# EAGLE schematic microsal2 (EAGLE 9.0.0)

## Sheet 1 of 4
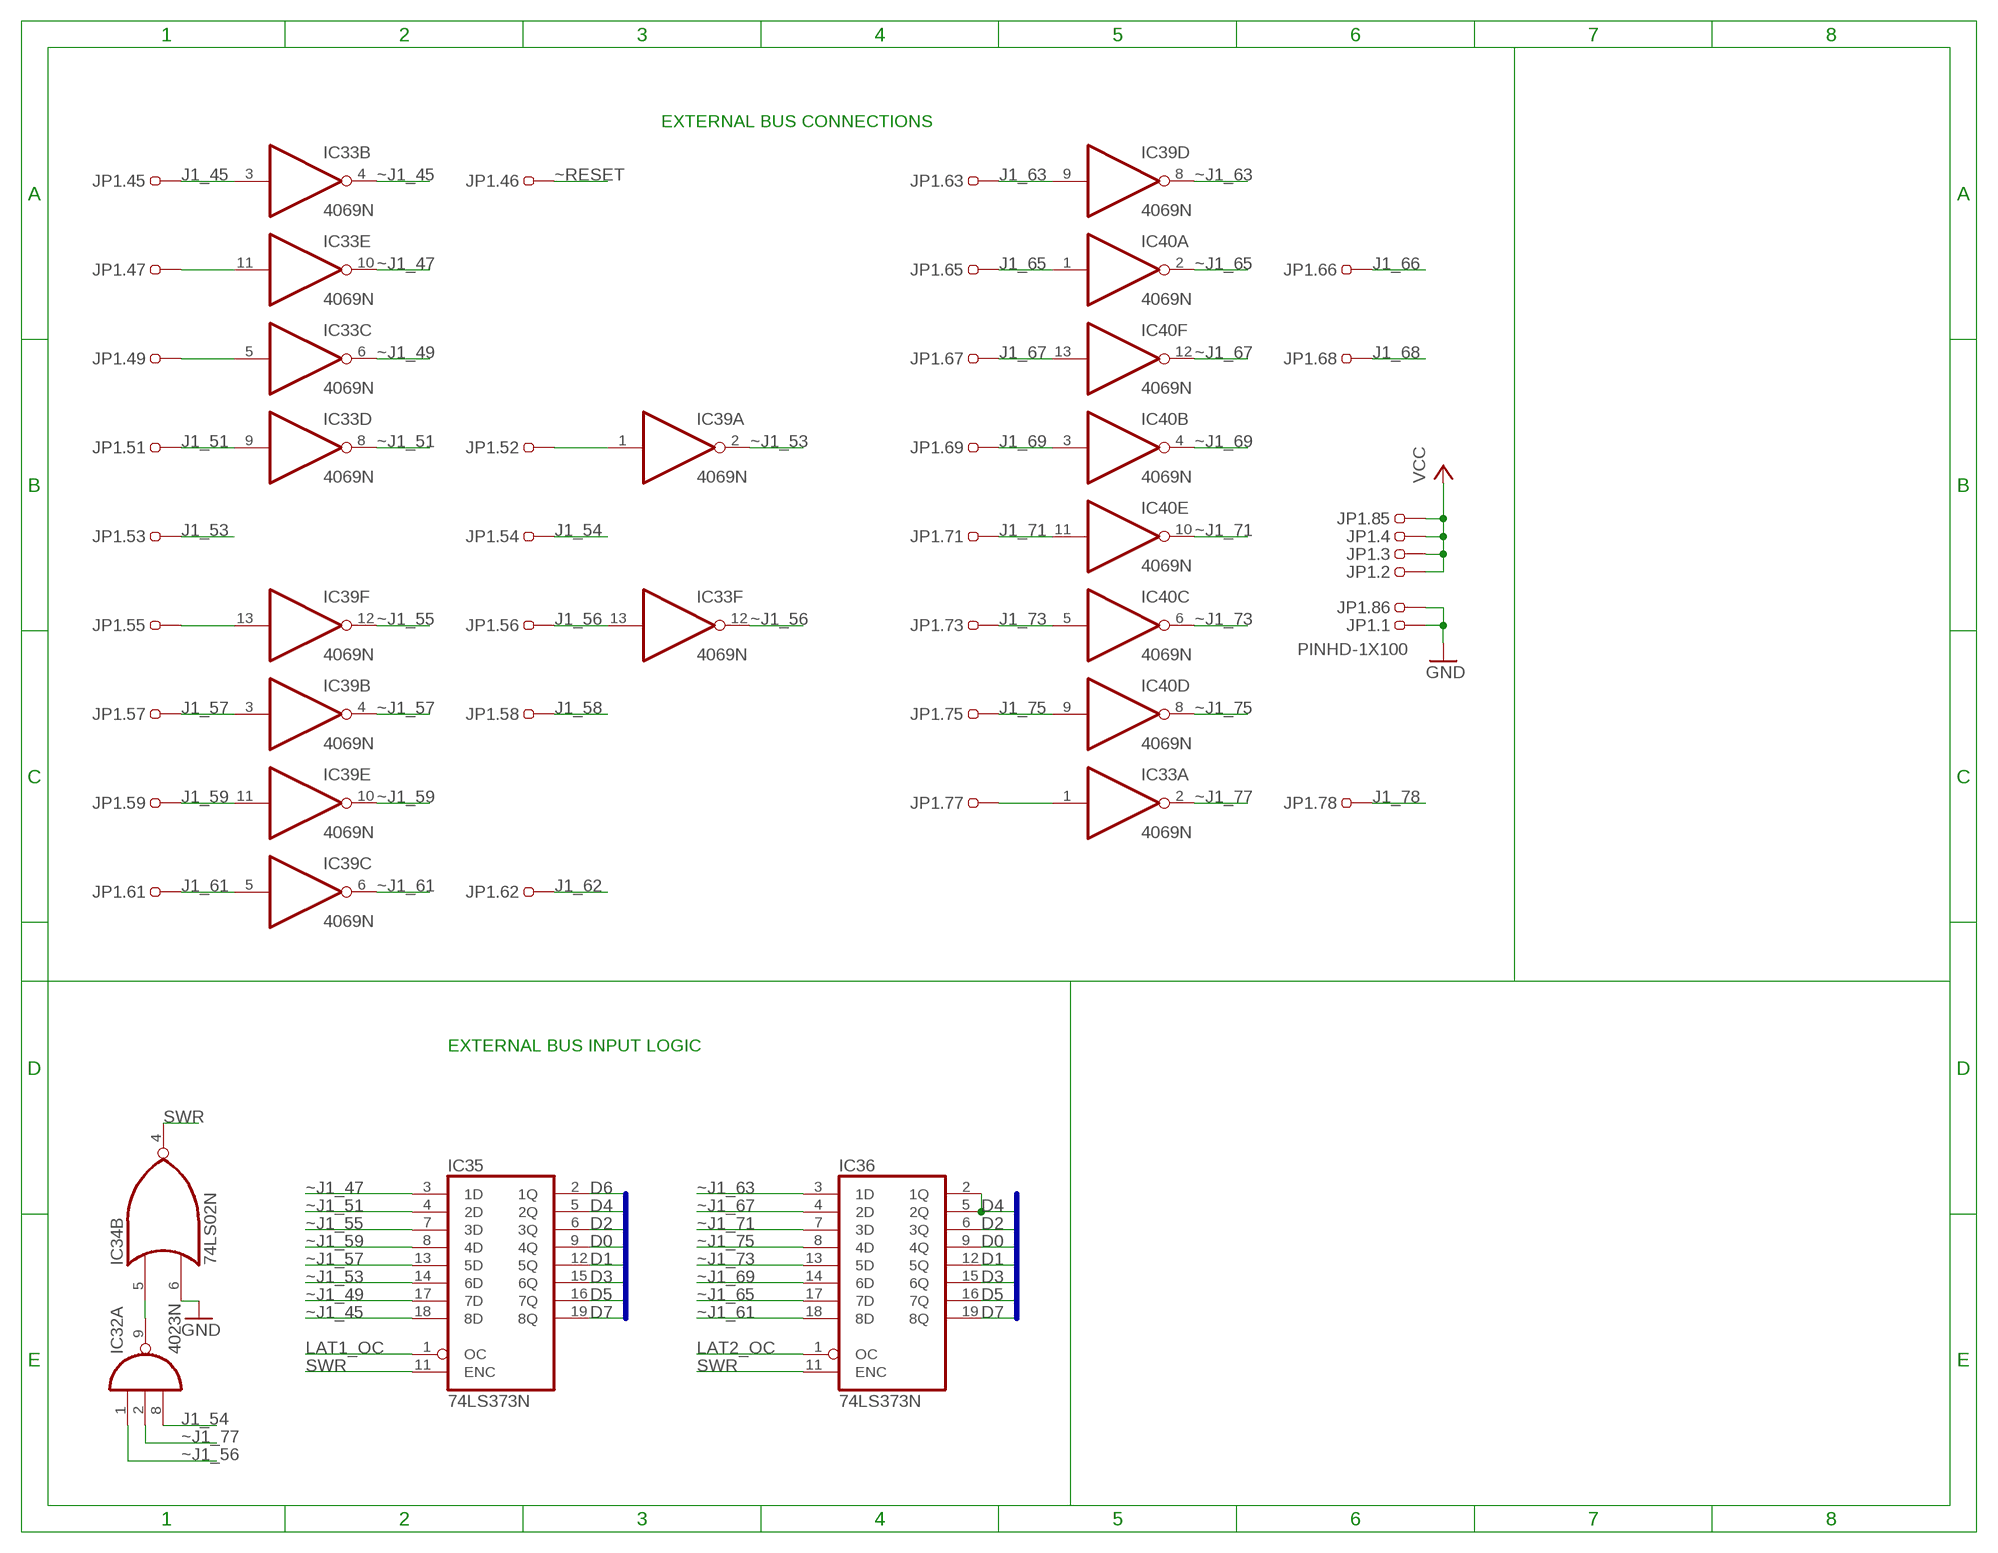
[diagram p0: schematic, sheet 1]

### Parts
IC32  4023N  [DIL14]
IC33  4069N  [DIL14]
IC34  74LS02N  [DIL14]
IC35  74LS373N  [DIL20]
IC36  74LS373N  [DIL20]
IC39  4069N  [DIL14]
IC40  4069N  [DIL14]
JP1  PINHD-1X100  [1X100]

### Nets
D0: IC35.9(4Q) IC36.9(4Q) ; also sheet 2,3,4
D1: IC35.12(5Q) IC36.12(5Q) ; also sheet 2,3,4
D2: IC35.6(3Q) IC36.6(3Q) ; also sheet 2,3,4
D3: IC35.15(6Q) IC36.15(6Q) ; also sheet 2,3,4
D4: IC35.5(2Q) IC36.2(1Q) IC36.5(2Q) ; also sheet 2,3,4
D5: IC35.16(7Q) IC36.16(7Q) ; also sheet 2,3,4
D6: IC35.2(1Q) ; also sheet 2,3,4
D7: IC35.19(8Q) IC36.19(8Q) ; also sheet 2,3,4
GND: IC34.6(B:I1) JP1.1 JP1.86 ; also sheet 2,3,4
J1_45: IC33.3(B:I) JP1.45 ; also sheet 3
J1_51: IC33.9(D:I) JP1.51 ; also sheet 3
J1_53: JP1.53 ; also sheet 3
J1_54: IC32.8(A:I2) JP1.54
J1_56: IC33.13(F:I) JP1.56 ; also sheet 3
J1_57: IC39.3(B:I) JP1.57 ; also sheet 3
J1_58: JP1.58 ; also sheet 3
J1_59: IC39.11(E:I) JP1.59 ; also sheet 3
J1_61: IC39.5(C:I) JP1.61 ; also sheet 3
J1_62: JP1.62 ; also sheet 3
J1_63: IC39.9(D:I) JP1.63 ; also sheet 3
J1_65: IC40.1(A:I) JP1.65 ; also sheet 3
J1_66: JP1.66 ; also sheet 3
J1_67: IC40.13(F:I) JP1.67 ; also sheet 3
J1_68: JP1.68 ; also sheet 3
J1_69: IC40.3(B:I) JP1.69 ; also sheet 3
J1_71: IC40.11(E:I) JP1.71 ; also sheet 3
J1_73: IC40.5(C:I) JP1.73 ; also sheet 3
J1_75: IC40.9(D:I) JP1.75 ; also sheet 3
J1_78: JP1.78 ; also sheet 2
LAT1_OC: IC35.1(OC) ; also sheet 4
LAT2_OC: IC36.1(OC) ; also sheet 4
N$130: IC33.1(A:I) JP1.77
N$132: IC32.9(A:O) IC34.5(B:I0)
N$133: IC33.11(E:I) JP1.47
N$135: IC39.13(F:I) JP1.55
N$138: IC39.1(A:I) JP1.52
N$139: IC33.5(C:I) JP1.49
SWR: IC34.4(B:O) IC35.11(ENC) IC36.11(ENC) ; also sheet 4
VCC: JP1.2 JP1.3 JP1.4 JP1.85 ; also sheet 2,3,4
~J1_45: IC33.4(B:O) IC35.18(8D)
~J1_47: IC33.10(E:O) IC35.3(1D)
~J1_49: IC33.6(C:O) IC35.17(7D)
~J1_51: IC33.8(D:O) IC35.4(2D)
~J1_53: IC35.14(6D) IC39.2(A:O)
~J1_55: IC35.7(3D) IC39.12(F:O)
~J1_56: IC32.1(A:I0) IC33.12(F:O)
~J1_57: IC35.13(5D) IC39.4(B:O)
~J1_59: IC35.8(4D) IC39.10(E:O)
~J1_61: IC36.18(8D) IC39.6(C:O)
~J1_63: IC36.3(1D) IC39.8(D:O)
~J1_65: IC36.17(7D) IC40.2(A:O)
~J1_67: IC36.4(2D) IC40.12(F:O)
~J1_69: IC36.14(6D) IC40.4(B:O)
~J1_71: IC36.7(3D) IC40.10(E:O)
~J1_73: IC36.13(5D) IC40.6(C:O)
~J1_75: IC36.8(4D) IC40.8(D:O)
~J1_77: IC32.2(A:I1) IC33.2(A:O) ; also sheet 3
~RESET: JP1.46 ; also sheet 2,4
Unconnected: IC32.3(B:I0) IC32.4(B:I1) IC32.5(B:I2) IC32.6(B:O) IC32.10(C:O) IC32.11(C:I0) IC32.12(C:I1) IC32.13(C:I2) IC34.1(A:O) IC34.2(A:I0) IC34.3(A:I1) IC34.8(C:I0) IC34.9(C:I1) IC34.10(C:O) IC34.11(D:I0) IC34.12(D:I1) IC34.13(D:O) JP1.5 JP1.6 JP1.7 JP1.8 JP1.9 JP1.10 JP1.11 JP1.12 JP1.13 JP1.14 JP1.15 JP1.16 JP1.17 JP1.18 JP1.19 JP1.20 JP1.21 JP1.22 JP1.23 JP1.24 JP1.25 JP1.26 JP1.27 JP1.28 JP1.29 JP1.30 JP1.31 JP1.32 JP1.33 JP1.34 JP1.35 JP1.36 JP1.37 JP1.38 JP1.39 JP1.40 JP1.41 JP1.42 JP1.43 JP1.44 JP1.48 JP1.50 JP1.60 JP1.64 JP1.70 JP1.72 JP1.74 JP1.76 JP1.79 JP1.80 JP1.81 JP1.82 JP1.83 JP1.84 JP1.87 JP1.88 JP1.89 JP1.90 JP1.91 JP1.92 JP1.93 JP1.94 JP1.95 JP1.96 JP1.97 JP1.98 JP1.99 JP1.100

### Buses
D[0..7]

### Notes on the sheet
- EXTERNAL BUS CONNECTIONS
- EXTERNAL BUS INPUT LOGIC

## Sheet 2 of 4
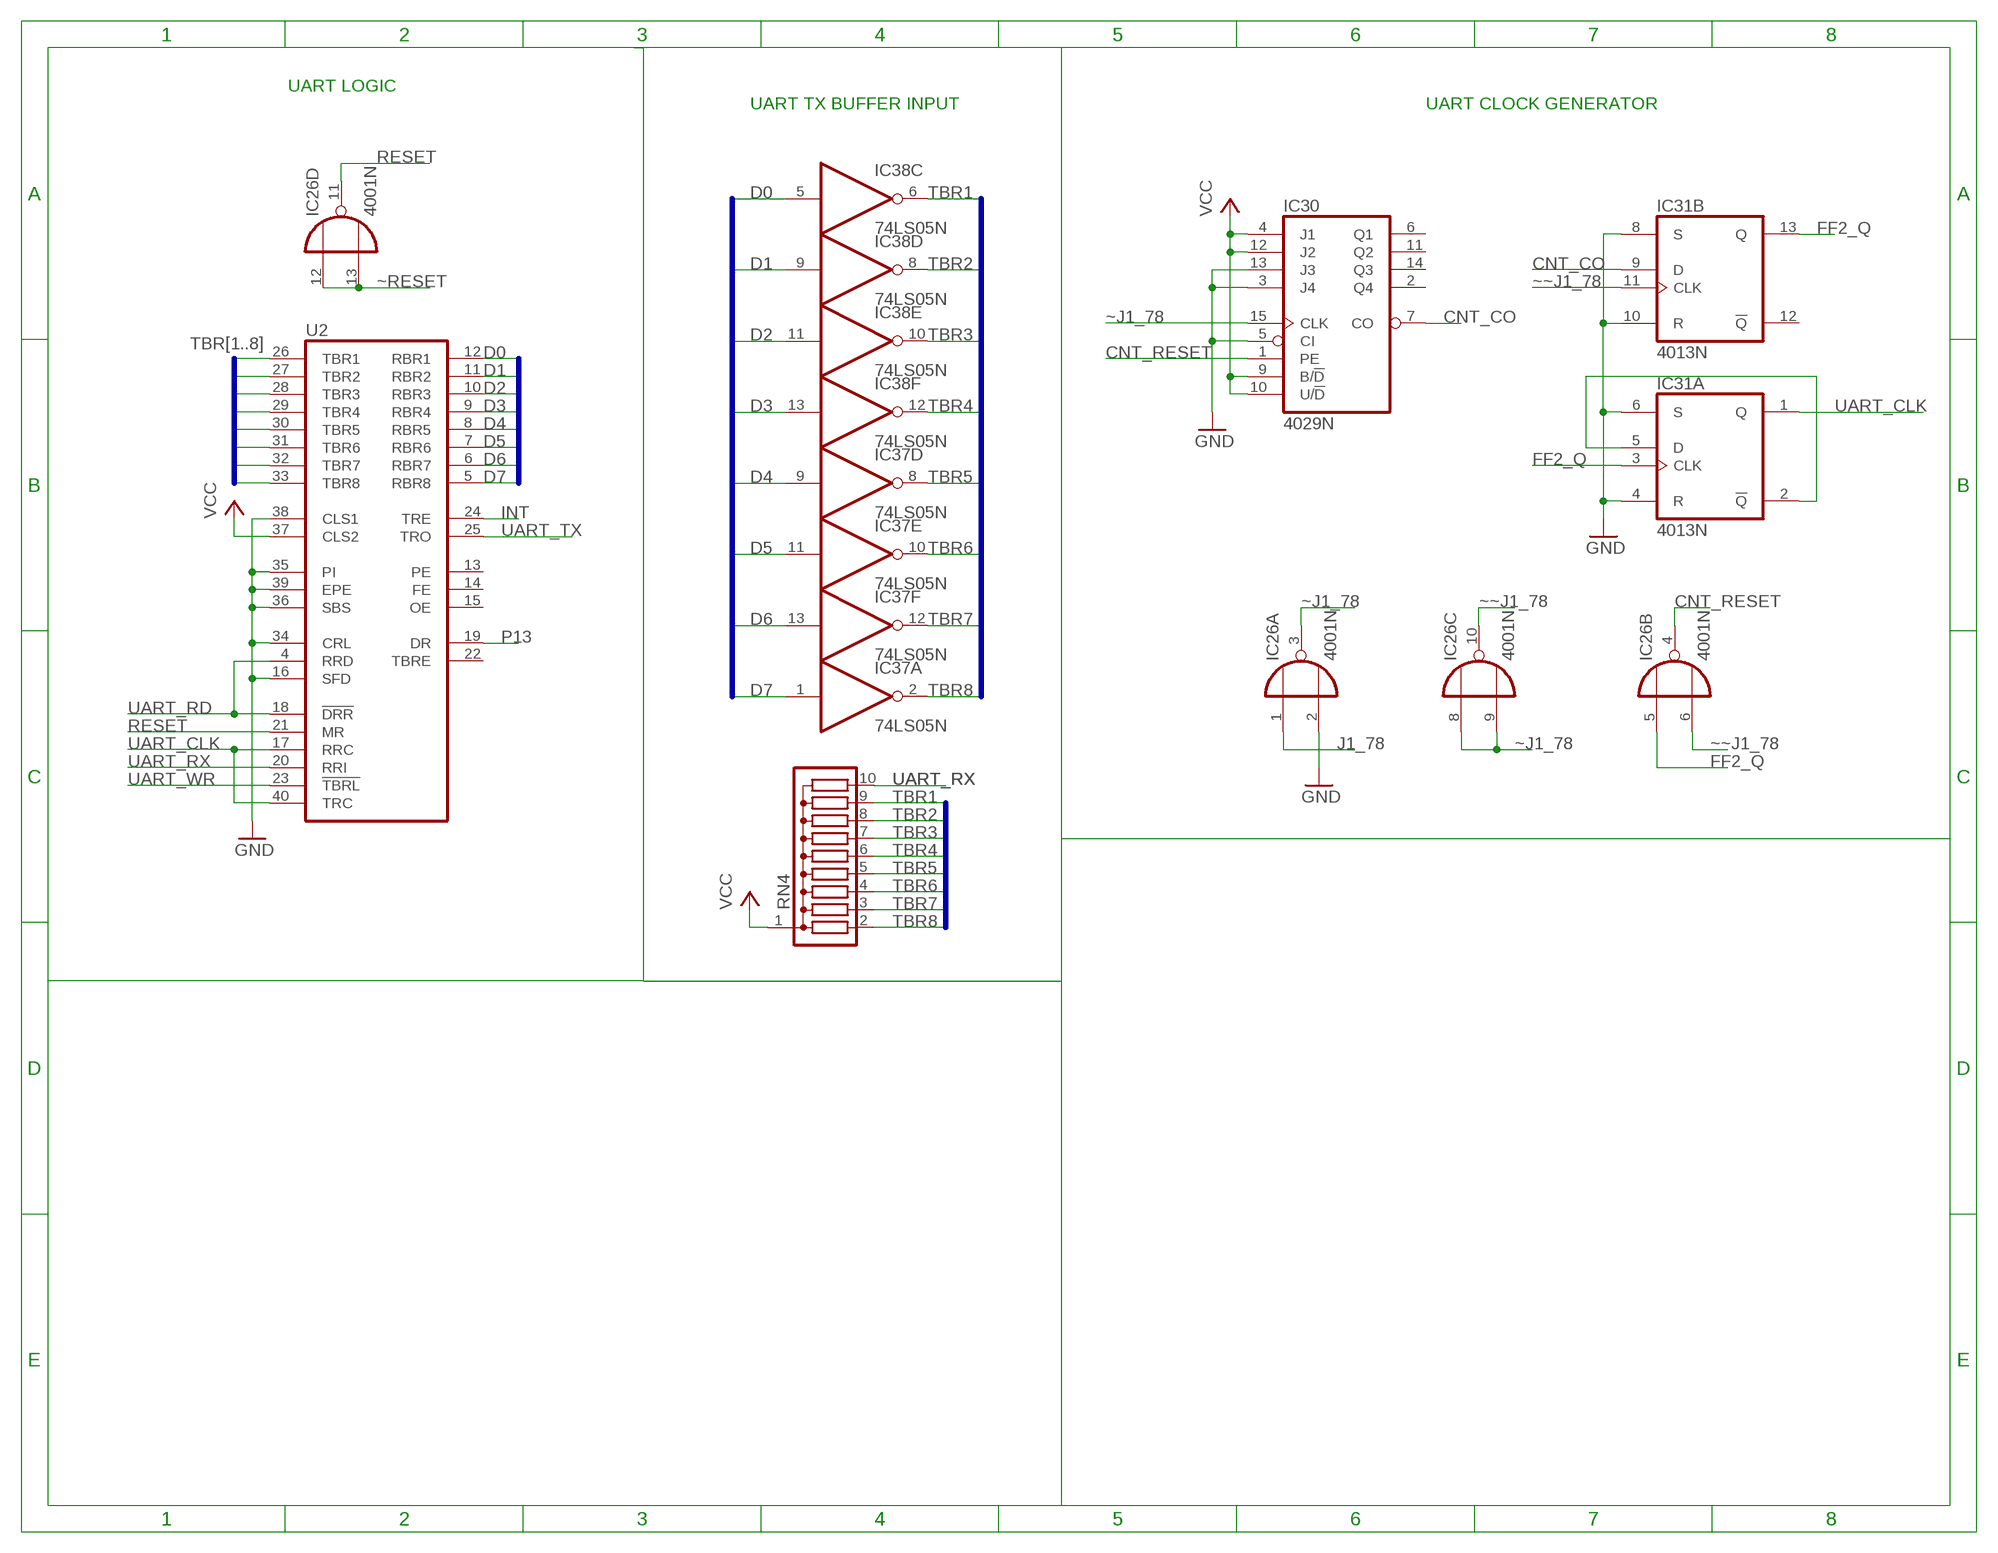
[diagram p1: schematic, sheet 2]

### Parts
IC26  4001N  [DIL14]
IC30  4029N  [DIL16]
IC31  4013N  [DIL14]
IC37  74LS05N  [DIL14]
IC38  74LS05N  [DIL14]
RN4  G09R  [SIL10]
U2  HD6402  [DIL40]

### Nets
CNT_CO: IC30.7(CO) IC31.9(B:D)
CNT_RESET: IC26.4(B:O) IC30.1(PE)
D0: IC38.5(C:I) U2.12(RBR1) ; also sheet 1,3,4
D1: IC38.9(D:I) U2.11(RBR2) ; also sheet 1,3,4
D2: IC38.11(E:I) U2.10(RBR3) ; also sheet 1,3,4
D3: IC38.13(F:I) U2.9(RBR4) ; also sheet 1,3,4
D4: IC37.9(D:I) U2.8(RBR5) ; also sheet 1,3,4
D5: IC37.11(E:I) U2.7(RBR6) ; also sheet 1,3,4
D6: IC37.13(F:I) U2.6(RBR7) ; also sheet 1,3,4
D7: IC37.1(A:I) U2.5(RBR8) ; also sheet 1,3,4
FF2_Q: IC26.5(B:I0) IC31.3(A:CLK) IC31.13(B:Q)
GND: IC26.2(A:I1) IC30.3(J4) IC30.5(CI) IC30.13(J3) IC31.4(A:R) IC31.6(A:S) IC31.8(B:S) IC31.10(B:R) U2.16(SFD) U2.34(CRL) U2.35(PI) U2.36(SBS) U2.38(CLS1) U2.39(EPE) ; also sheet 1,3,4
INT: U2.24(TRE) ; also sheet 4
J1_78: IC26.1(A:I0) ; also sheet 1
N$40: IC31.2(A:!Q) IC31.5(A:D)
P13: U2.19(DR) ; also sheet 4
RESET: IC26.11(D:O) U2.21(MR)
TBR1: IC38.6(C:O) RN4.9 U2.26(TBR1)
TBR2: IC38.8(D:O) RN4.8 U2.27(TBR2)
TBR3: IC38.10(E:O) RN4.7 U2.28(TBR3)
TBR4: IC38.12(F:O) RN4.6 U2.29(TBR4)
TBR5: IC37.8(D:O) RN4.5 U2.30(TBR5)
TBR6: IC37.10(E:O) RN4.4 U2.31(TBR6)
TBR7: IC37.12(F:O) RN4.3 U2.32(TBR7)
TBR8: IC37.2(A:O) RN4.2 U2.33(TBR8)
UART_CLK: IC31.1(A:Q) U2.17(RRC) U2.40(TRC)
UART_RD: U2.4(RRD) U2.18(!DRR) ; also sheet 4
UART_RX: RN4.10 U2.20(RRI) ; also sheet 4
UART_TX: U2.25(TRO) ; also sheet 4
UART_WR: U2.23(!TBRL) ; also sheet 4
VCC: IC30.4(J1) IC30.9(B/!D) IC30.10(U/!D) IC30.12(J2) RN4.1 U2.37(CLS2) ; also sheet 1,3,4
~J1_78: IC26.3(A:O) IC26.8(C:I0) IC26.9(C:I1) IC30.15(CLK)
~RESET: IC26.12(D:I0) IC26.13(D:I1) ; also sheet 1,4
~~J1_78: IC26.6(B:I1) IC26.10(C:O) IC31.11(B:CLK)
Unconnected: IC30.2(Q4) IC30.6(Q1) IC30.11(Q2) IC30.14(Q3) IC31.12(B:!Q) IC37.3(B:I) IC37.4(B:O) IC37.5(C:I) IC37.6(C:O) IC38.1(A:I) IC38.2(A:O) IC38.3(B:I) IC38.4(B:O) U2.13(PE) U2.14(FE) U2.15(OE) U2.22(TBRE)

### Buses
D[0..7]
TBR[1..8]

### Notes on the sheet
- UART LOGIC
- UART TX BUFFER INPUT | UART CLOCK GENERATOR

## Sheet 3 of 4
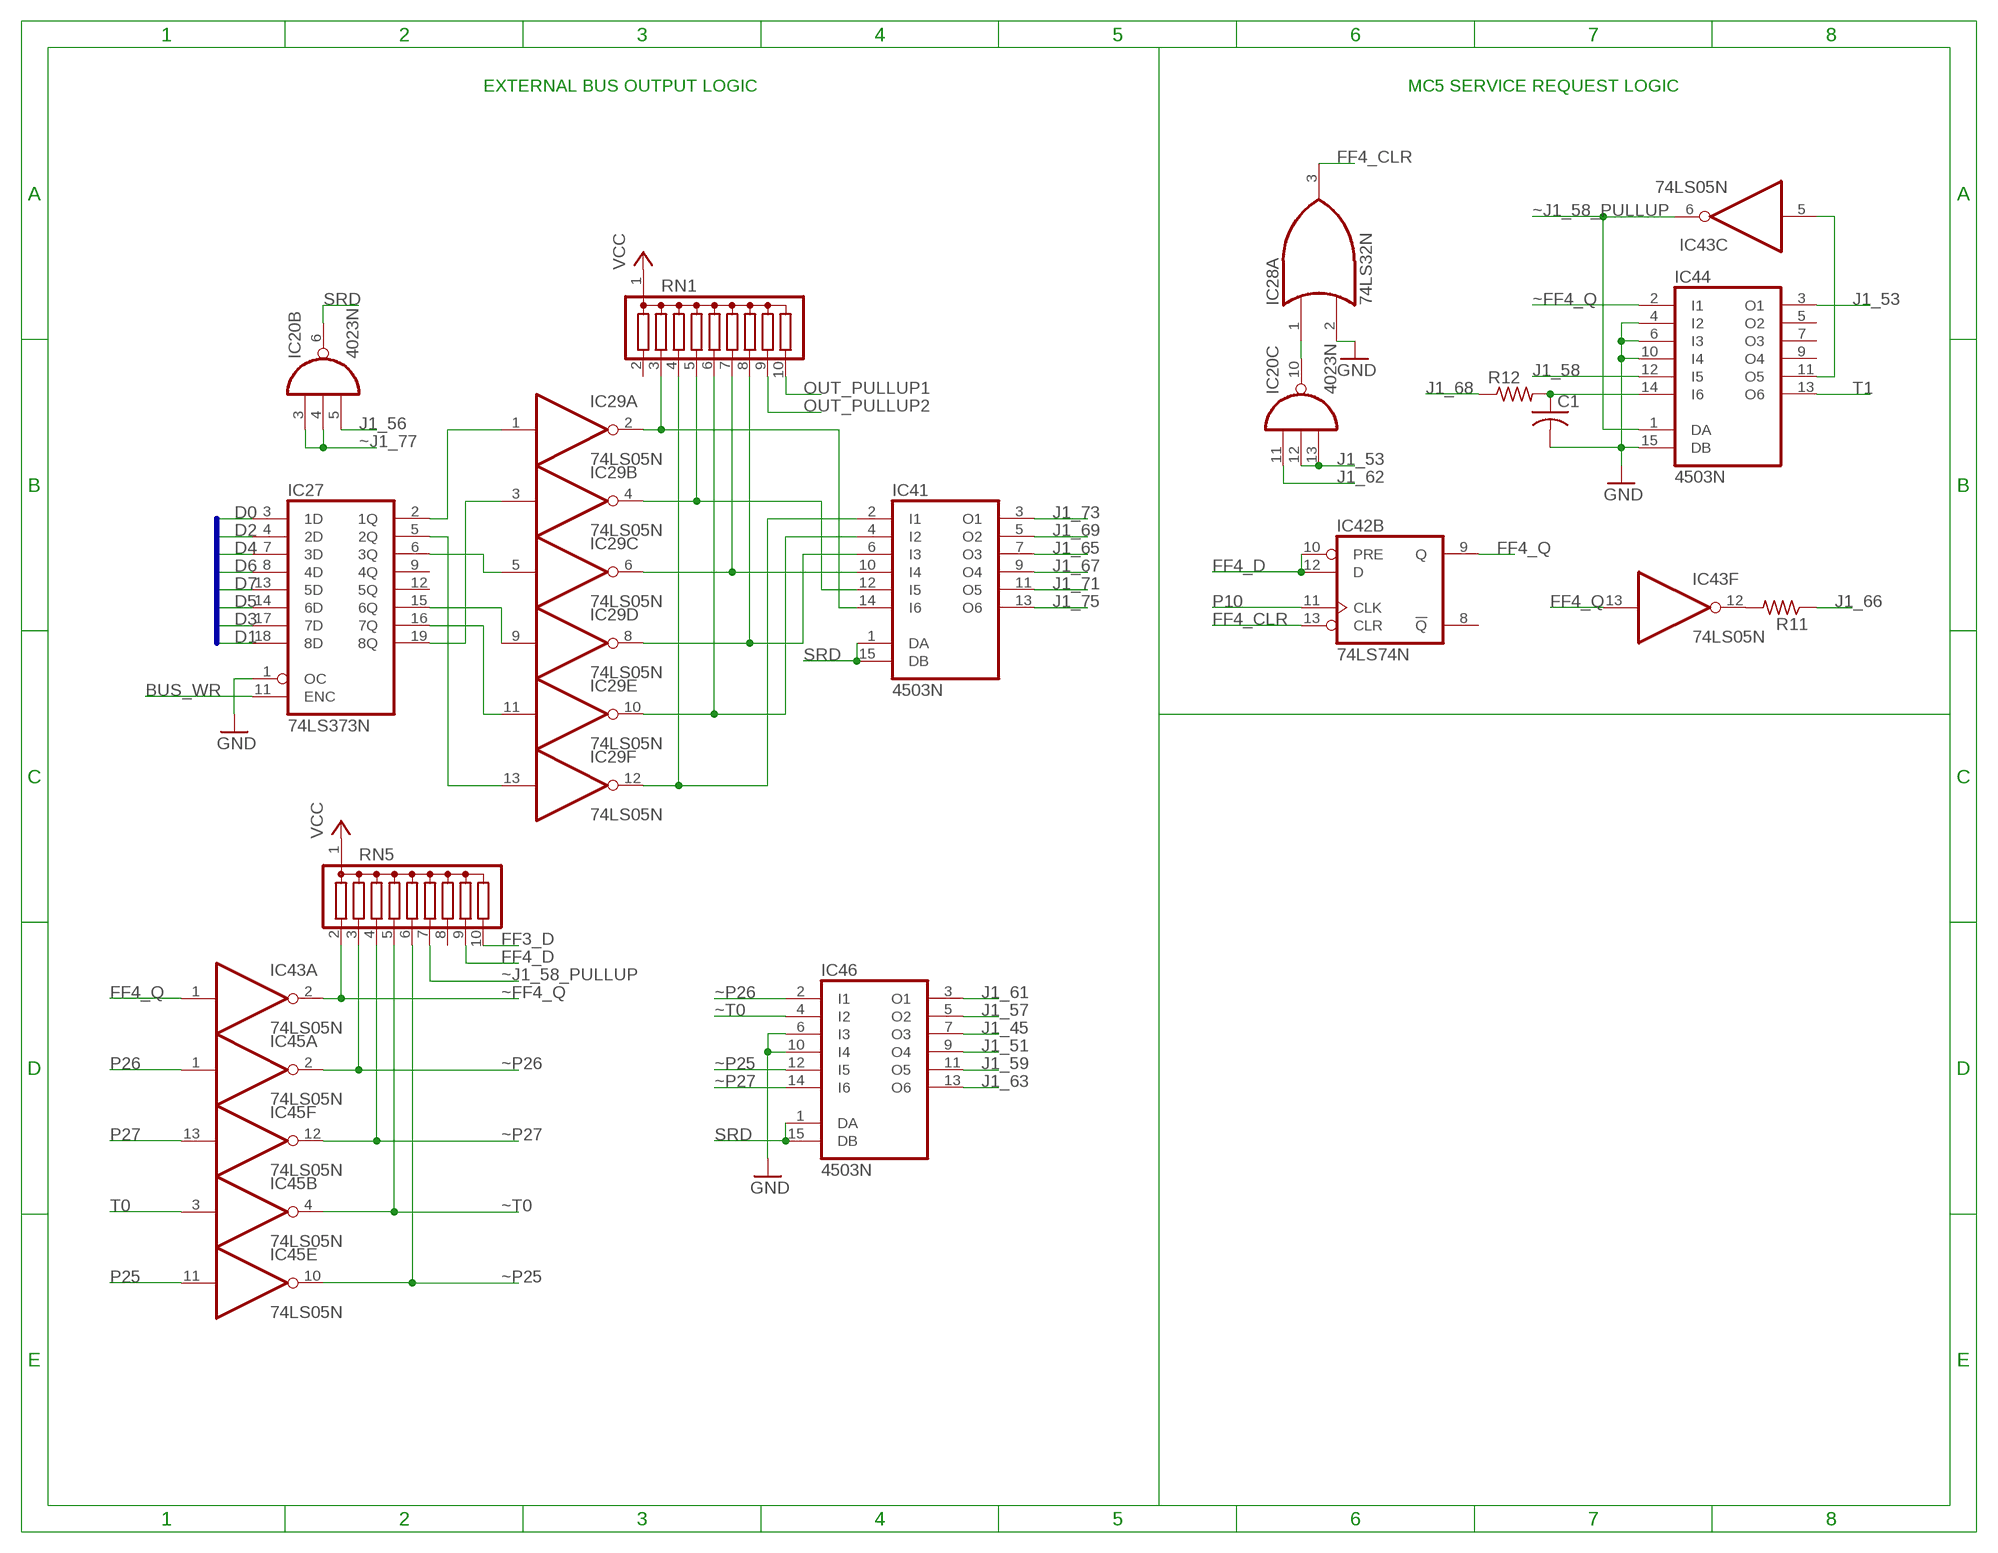
[diagram p2: schematic, sheet 3]

### Parts
C1  C-US050-025X075  [C050-025X075]
IC20  4023N  [DIL14]
IC27  74LS373N  [DIL20]
IC28  74LS32N  [DIL14]
IC29  74LS05N  [DIL14]
IC41  4503N  [DIL16]
IC42  74LS74N  [DIL14]
IC43  74LS05N  [DIL14]
IC44  4503N  [DIL16]
IC45  74LS05N  [DIL14]
IC46  4503N  [DIL16]
R11  R-US_0207/10  [0207/10]
R12  R-US_0207/10  [0207/10]
RN1  G09R  [SIL10]
RN5  G09R  [SIL10]

### Nets
BUS_WR: IC27.11(ENC) ; also sheet 4
D0: IC27.3(1D) ; also sheet 1,2,4
D1: IC27.18(8D) ; also sheet 1,2,4
D2: IC27.4(2D) ; also sheet 1,2,4
D3: IC27.17(7D) ; also sheet 1,2,4
D4: IC27.7(3D) ; also sheet 1,2,4
D5: IC27.14(6D) ; also sheet 1,2,4
D6: IC27.8(4D) ; also sheet 1,2,4
D7: IC27.13(5D) ; also sheet 1,2,4
FF3_D: RN5.10 ; also sheet 4
FF4_CLR: IC28.3(A:O) IC42.13(B:CLR)
FF4_D: IC42.10(B:PRE) IC42.12(B:D) RN5.9
FF4_Q: IC42.9(B:Q) IC43.1(A:I) IC43.13(F:I)
GND: C1.2 IC27.1(OC) IC28.2(A:I1) IC44.4(I2) IC44.6(I3) IC44.10(I4) IC44.15(DB) IC46.6(I3) IC46.10(I4) ; also sheet 1,2,4
J1_45: IC46.7(O3) ; also sheet 1
J1_51: IC46.9(O4) ; also sheet 1
J1_53: IC20.12(C:I1) IC20.13(C:I2) IC44.3(O1) ; also sheet 1
J1_56: IC20.5(B:I2) ; also sheet 1
J1_57: IC46.5(O2) ; also sheet 1
J1_58: IC44.12(I5) ; also sheet 1
J1_59: IC46.11(O5) ; also sheet 1
J1_61: IC46.3(O1) ; also sheet 1
J1_62: IC20.11(C:I0) ; also sheet 1
J1_63: IC46.13(O6) ; also sheet 1
J1_65: IC41.7(O3) ; also sheet 1
J1_66: R11.1 ; also sheet 1
J1_67: IC41.9(O4) ; also sheet 1
J1_68: R12.1 ; also sheet 1
J1_69: IC41.5(O2) ; also sheet 1
J1_71: IC41.11(O5) ; also sheet 1
J1_73: IC41.3(O1) ; also sheet 1
J1_75: IC41.13(O6) ; also sheet 1
N$36: IC27.2(1Q) IC29.1(A:I)
N$38: IC27.5(2Q) IC29.13(F:I)
N$39: IC27.6(3Q) IC29.5(C:I)
N$41: IC27.15(6Q) IC29.9(D:I)
N$42: IC27.16(7Q) IC29.11(E:I)
N$43: IC27.19(8Q) IC29.3(B:I)
N$44: IC29.2(A:O) IC41.14(I6) RN1.3
N$45: IC29.4(B:O) IC41.12(I5) RN1.5
N$46: IC29.6(C:O) IC41.10(I4) RN1.7
N$47: IC29.8(D:O) IC41.6(I3) RN1.8
N$48: IC29.10(E:O) IC41.4(I2) RN1.6
N$49: IC29.12(F:O) IC41.2(I1) RN1.4
N$50: IC20.10(C:O) IC28.1(A:I0)
N$51: IC43.12(F:O) R11.2
N$52: C1.1 IC44.14(I6) R12.2
N$53: IC43.5(C:I) IC44.11(O5)
OUT_PULLUP1: RN1.10 ; also sheet 4
OUT_PULLUP2: RN1.9 ; also sheet 4
P10: IC42.11(B:CLK) ; also sheet 4
P25: IC45.11(E:I) ; also sheet 4
P26: IC45.1(A:I) ; also sheet 4
P27: IC45.13(F:I) ; also sheet 4
SRD: IC20.6(B:O) IC41.1(DA) IC41.15(DB) IC46.1(DA) IC46.15(DB)
T0: IC45.3(B:I) ; also sheet 4
T1: IC44.13(O6) ; also sheet 4
VCC: RN1.1 RN5.1 ; also sheet 1,2,4
~FF4_Q: IC43.2(A:O) IC44.2(I1) RN5.2
~J1_58_PULLUP: IC43.6(C:O) IC44.1(DA) RN5.7
~J1_77: IC20.3(B:I0) IC20.4(B:I1) ; also sheet 1
~P25: IC45.10(E:O) IC46.12(I5) RN5.6
~P26: IC45.2(A:O) IC46.2(I1) RN5.3
~P27: IC45.12(F:O) IC46.14(I6) RN5.4
~T0: IC45.4(B:O) IC46.4(I2) RN5.5
Unconnected: IC20.1(A:I0) IC20.2(A:I1) IC20.8(A:I2) IC20.9(A:O) IC27.9(4Q) IC27.12(5Q) IC28.4(B:I0) IC28.5(B:I1) IC28.6(B:O) IC28.8(C:O) IC28.9(C:I0) IC28.10(C:I1) IC28.11(D:O) IC28.12(D:I0) IC28.13(D:I1) IC42.1(A:CLR) IC42.2(A:D) IC42.3(A:CLK) IC42.4(A:PRE) IC42.5(A:Q) IC42.6(A:!Q) IC42.8(B:!Q) IC43.3(B:I) IC43.4(B:O) IC43.8(D:O) IC43.9(D:I) IC43.10(E:O) IC43.11(E:I) IC44.5(O2) IC44.7(O3) IC44.9(O4) IC45.5(C:I) IC45.6(C:O) IC45.8(D:O) IC45.9(D:I) RN1.2 RN5.8

### Buses
D[0..7]

### Notes on the sheet
- EXTERNAL BUS OUTPUT LOGIC | MC5 SERVICE REQUEST LOGIC

## Sheet 4 of 4
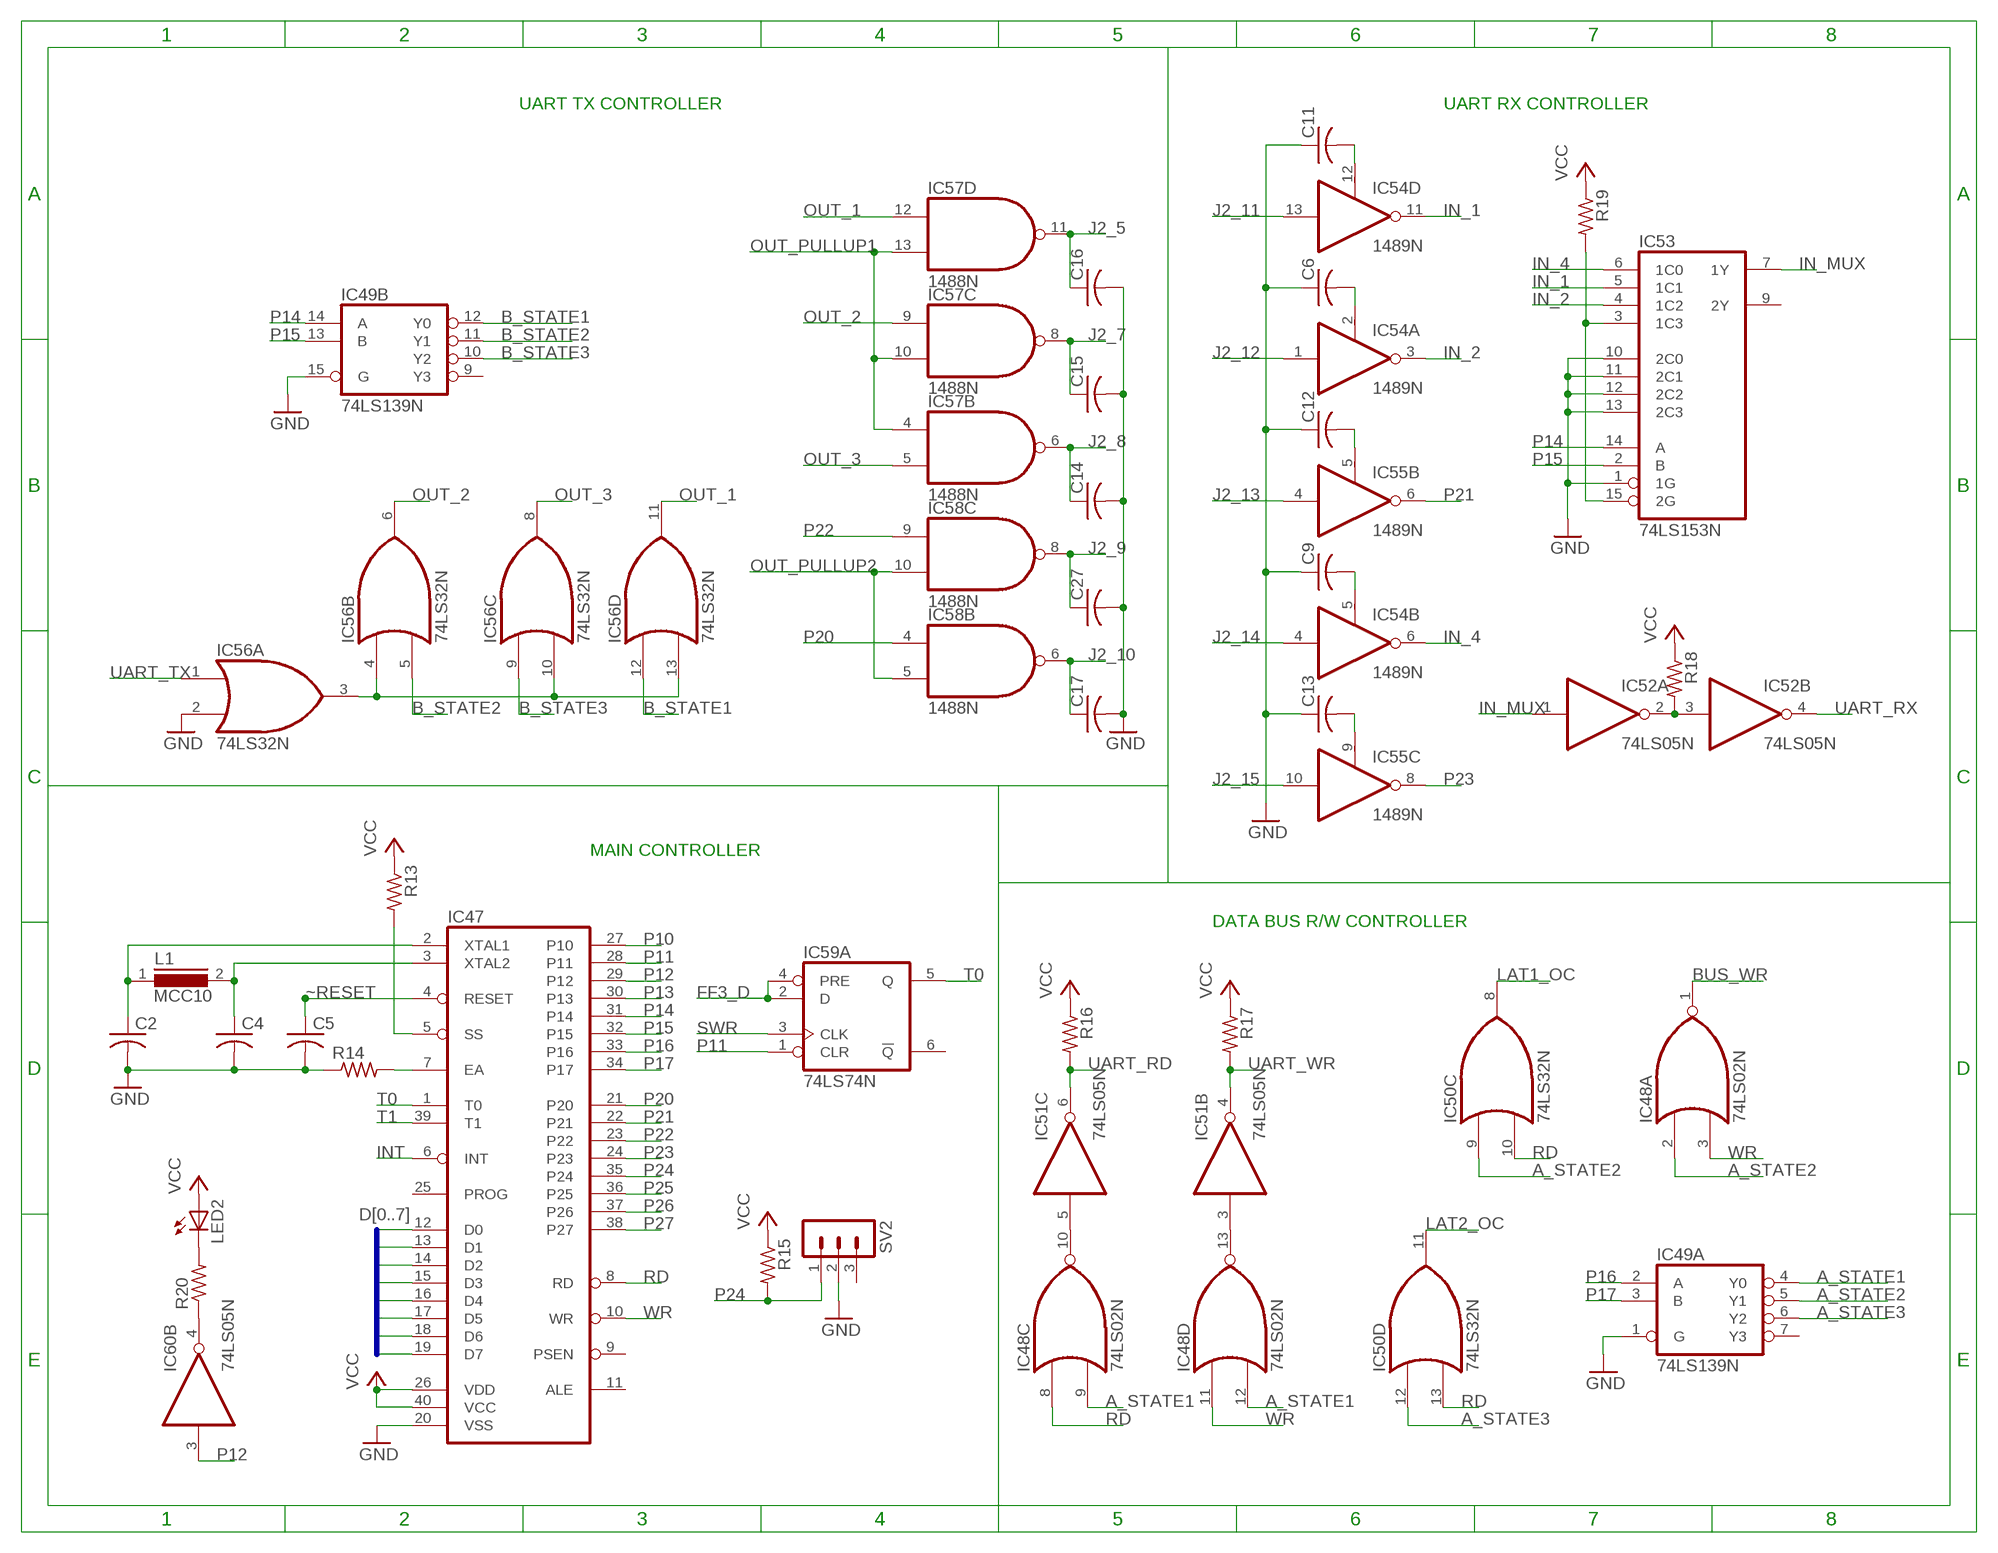
[diagram p3: schematic, sheet 4]

### Parts
C2  C-US050-025X075  [C050-025X075]
C4  C-US050-025X075  [C050-025X075]
C5  C-US050-025X075  [C050-025X075]
C6  C-US050-025X075  [C050-025X075]
C9  C-US050-025X075  [C050-025X075]
C11  C-US050-025X075  [C050-025X075]
C12  C-US050-025X075  [C050-025X075]
C13  C-US050-025X075  [C050-025X075]
C14  C-US050-025X075  [C050-025X075]
C15  C-US050-025X075  [C050-025X075]
C16  C-US050-025X075  [C050-025X075]
C17  C-US050-025X075  [C050-025X075]
C27  C-US050-025X075  [C050-025X075]
IC47  8749  [DIL40]
IC48  74LS02N  [DIL14]
IC49  74LS139N  [DIL16]
IC50  74LS32N  [DIL14]
IC51  74LS05N  [DIL14]
IC52  74LS05N  [DIL14]
IC53  74LS153N  [DIL16]
IC54  1489N  [DIL14]
IC55  1489N  [DIL14]
IC56  74LS32N  [DIL14]
IC57  1488N  [DIL14]
IC58  1488N  [DIL14]
IC59  74LS74N  [DIL14]
IC60  74LS05N  [DIL14]
L1  MCC10  [MCC10]
LED2  LED5MM  [LED5MM]
R13  R-US_0207/10  [0207/10]
R14  R-US_0207/10  [0207/10]
R15  R-US_0207/10  [0207/10]
R16  R-US_0207/10  [0207/10]
R17  R-US_0207/10  [0207/10]
R18  R-US_0207/10  [0207/10]
R19  R-US_0207/10  [0207/10]
R20  R-US_0207/10  [0207/10]
SV2  MA03-1  [MA03-1]

### Nets
A_STATE1: IC48.9(C:I1) IC48.12(D:I1) IC49.4(A:Y0)
A_STATE2: IC48.2(A:I0) IC49.5(A:Y1) IC50.9(C:I0)
A_STATE3: IC49.6(A:Y2) IC50.12(D:I0)
B_STATE1: IC49.12(B:Y0) IC56.12(D:I0)
B_STATE2: IC49.11(B:Y1) IC56.5(B:I1)
B_STATE3: IC49.10(B:Y2) IC56.9(C:I0)
BUS_WR: IC48.1(A:O) ; also sheet 3
D0: IC47.12(D0) ; also sheet 1,2,3
D1: IC47.13(D1) ; also sheet 1,2,3
D2: IC47.14(D2) ; also sheet 1,2,3
D3: IC47.15(D3) ; also sheet 1,2,3
D4: IC47.16(D4) ; also sheet 1,2,3
D5: IC47.17(D5) ; also sheet 1,2,3
D6: IC47.18(D6) ; also sheet 1,2,3
D7: IC47.19(D7) ; also sheet 1,2,3
FF3_D: IC59.2(A:D) IC59.4(A:PRE) ; also sheet 3
GND: C2.2 C4.2 C5.2 C6.1 C9.1 C11.1 C12.1 C13.1 C14.2 C15.2 C16.2 C17.2 C27.2 IC47.20(VSS) IC49.1(A:G) IC49.15(B:G) IC53.1(1G) IC53.10(2C0) IC53.11(2C1) IC53.12(2C2) IC53.13(2C3) IC56.2(A:I1) R14.1 SV2.2 ; also sheet 1,2,3
IN_1: IC53.5(1C1) IC54.11(D:O)
IN_2: IC53.4(1C2) IC54.3(A:O)
IN_4: IC53.6(1C0) IC54.6(B:O)
IN_MUX: IC52.1(A:I) IC53.7(1Y)
INT: IC47.6(INT) ; also sheet 2
J2_5: C16.1 IC57.11(D:O)
J2_7: C15.1 IC57.8(C:O)
J2_8: C14.1 IC57.6(B:O)
J2_9: C27.1 IC58.8(C:O)
J2_10: C17.1 IC58.6(B:O)
J2_11: IC54.13(D:I)
J2_12: IC54.1(A:I)
J2_13: IC55.4(B:I)
J2_14: IC54.4(B:I)
J2_15: IC55.10(C:I)
LAT1_OC: IC50.8(C:O) ; also sheet 1
LAT2_OC: IC50.11(D:O) ; also sheet 1
N$59: C2.1 IC47.2(XTAL1) L1.1
N$60: C4.1 IC47.3(XTAL2) L1.2
N$61: IC47.5(SS) R13.2
N$62: IC47.7(EA) R14.2
N$63: IC48.10(C:O) IC51.5(C:I)
N$64: IC48.13(D:O) IC51.3(B:I)
N$65: C6.2 IC54.2(A:RC)
N$66: C9.2 IC54.5(B:RC)
N$67: C11.2 IC54.12(D:RC)
N$68: C12.2 IC55.5(B:RC)
N$69: C13.2 IC55.9(C:RC)
N$70: IC53.3(1C3) IC53.15(2G) R19.2
N$71: IC56.3(A:O) IC56.4(B:I0) IC56.10(C:I1) IC56.13(D:I1)
N$72: LED2.K(C) R20.2
N$73: IC60.4(B:O) R20.1
N$74: IC52.2(A:O) IC52.3(B:I) R18.2
OUT_1: IC56.11(D:O) IC57.12(D:I0)
OUT_2: IC56.6(B:O) IC57.9(C:I0)
OUT_3: IC56.8(C:O) IC57.5(B:I1)
OUT_PULLUP1: IC57.4(B:I0) IC57.10(C:I1) IC57.13(D:I1) ; also sheet 3
OUT_PULLUP2: IC58.5(B:I1) IC58.10(C:I1) ; also sheet 3
P10: IC47.27(P10) ; also sheet 3
P11: IC47.28(P11) IC59.1(A:CLR)
P12: IC47.29(P12) IC60.3(B:I)
P13: IC47.30(P13) ; also sheet 2
P14: IC47.31(P14) IC49.14(B:A) IC53.14(A)
P15: IC47.32(P15) IC49.13(B:B) IC53.2(B)
P16: IC47.33(P16) IC49.2(A:A)
P17: IC47.34(P17) IC49.3(A:B)
P20: IC47.21(P20) IC58.4(B:I0)
P21: IC47.22(P21) IC55.6(B:O)
P22: IC47.23(P22) IC58.9(C:I0)
P23: IC47.24(P23) IC55.8(C:O)
P24: IC47.35(P24) R15.2 SV2.1
P25: IC47.36(P25) ; also sheet 3
P26: IC47.37(P26) ; also sheet 3
P27: IC47.38(P27) ; also sheet 3
RD: IC47.8(RD) IC48.8(C:I0) IC50.10(C:I1) IC50.13(D:I1)
SWR: IC59.3(A:CLK) ; also sheet 1
T0: IC47.1(T0) IC59.5(A:Q) ; also sheet 3
T1: IC47.39(T1) ; also sheet 3
UART_RD: IC51.6(C:O) R16.2 ; also sheet 2
UART_RX: IC52.4(B:O) ; also sheet 2
UART_TX: IC56.1(A:I0) ; also sheet 2
UART_WR: IC51.4(B:O) R17.2 ; also sheet 2
VCC: IC47.26(VDD) IC47.40(VCC) LED2.A R13.1 R15.1 R16.1 R17.1 R18.1 R19.1 ; also sheet 1,2,3
WR: IC47.10(WR) IC48.3(A:I1) IC48.11(D:I0)
~RESET: C5.1 IC47.4(RESET) ; also sheet 1,2
Unconnected: IC47.9(PSEN) IC47.11(ALE) IC47.25(PROG) IC48.4(B:O) IC48.5(B:I0) IC48.6(B:I1) IC49.7(A:Y3) IC49.9(B:Y3) IC50.1(A:I0) IC50.2(A:I1) IC50.3(A:O) IC50.4(B:I0) IC50.5(B:I1) IC50.6(B:O) IC51.1(A:I) IC51.2(A:O) IC51.8(D:O) IC51.9(D:I) IC51.10(E:O) IC51.11(E:I) IC51.12(F:O) IC51.13(F:I) IC52.5(C:I) IC52.6(C:O) IC52.8(D:O) IC52.9(D:I) IC52.10(E:O) IC52.11(E:I) IC52.12(F:O) IC52.13(F:I) IC53.9(2Y) IC54.8(C:O) IC54.9(C:RC) IC54.10(C:I) IC55.1(A:I) IC55.2(A:RC) IC55.3(A:O) IC55.11(D:O) IC55.12(D:RC) IC55.13(D:I) IC57.2(A:I) IC57.3(A:O) IC58.2(A:I) IC58.3(A:O) IC58.11(D:O) IC58.12(D:I0) IC58.13(D:I1) IC59.6(A:!Q) IC59.8(B:!Q) IC59.9(B:Q) IC59.10(B:PRE) IC59.11(B:CLK) IC59.12(B:D) IC59.13(B:CLR) IC60.1(A:I) IC60.2(A:O) IC60.5(C:I) IC60.6(C:O) IC60.8(D:O) IC60.9(D:I) IC60.10(E:O) IC60.11(E:I) IC60.12(F:O) IC60.13(F:I) SV2.3

### Buses
D[0..7]

### Notes on the sheet
- UART TX CONTROLLER | UART RX CONTROLLER
- MAIN CONTROLLER
- DATA BUS R/W CONTROLLER

## Power pins joined to a net without a drawn wire
+12V: IC57.14(P:+12V) IC58.14(P:+12V)
-12V: IC57.1(P:-12V) IC58.1(P:-12V)
GND: IC27.10(GND) IC28.7(P:GND) IC29.7(P:GND) IC34.7(P:GND) IC35.10(GND) IC36.10(GND) IC37.7(P:GND) IC38.7(P:GND) IC42.7(P:GND) IC43.7(P:GND) IC45.7(P:GND) IC48.7(P:GND) IC49.8(P:GND) IC50.7(P:GND) IC51.7(P:GND) IC52.7(P:GND) IC53.8(GND) IC54.7(P:GND) IC55.7(P:GND) IC56.7(P:GND) IC57.7(P:GND) IC58.7(P:GND) IC59.7(P:GND) IC60.7(P:GND) U2.3(GND)
VCC: IC27.20(VCC) IC28.14(P:VCC) IC29.14(P:VCC) IC34.14(P:VCC) IC35.20(VCC) IC36.20(VCC) IC37.14(P:VCC) IC38.14(P:VCC) IC42.14(P:VCC) IC43.14(P:VCC) IC45.14(P:VCC) IC48.14(P:VCC) IC49.16(P:VCC) IC50.14(P:VCC) IC51.14(P:VCC) IC52.14(P:VCC) IC53.16(VCC) IC54.14(P:VCC) IC55.14(P:VCC) IC56.14(P:VCC) IC59.14(P:VCC) IC60.14(P:VCC) U2.1(VCC)
VDD: IC20.14(P:VDD) IC26.14(P:VDD) IC30.16(VDD) IC31.14(P:VDD) IC32.14(P:VDD) IC33.14(P:VDD) IC39.14(P:VDD) IC40.14(P:VDD) IC41.16(VDD) IC44.16(VDD) IC46.16(VDD)
VSS: IC20.7(P:VSS) IC26.7(P:VSS) IC30.8(VSS) IC31.7(P:VSS) IC32.7(P:VSS) IC33.7(P:VSS) IC39.7(P:VSS) IC40.7(P:VSS) IC41.8(VSS) IC44.8(VSS) IC46.8(VSS)

## Library data of the parts
C1 C2 C4-C6 C9 C11-C17 C27 = resistor:C-US: CAPACITOR, American symbol
IC20 IC32 = 40xx:4023: Triple 3-input NAND
IC26 = 40xx:4001: Quad 2-input NOR
IC27 IC35 IC36 = 74xx-us:74*373: Octal D type transparent LATCH, edge triggered
IC28 IC50 IC56 = 74xx-us:74*32: Quad 2-input OR gate
IC29 IC37 IC38 IC43 IC45 IC51 IC52 IC60 = 74xx-us:74*05: Hex INVERTER, open collector
IC30 = 40xx:4029: Binary/decimal up/down COUNTER
IC31 = 40xx:4013: Dual D FLIP FLOP, set/reset
IC33 IC39 IC40 = 40xx:4069: Hex INVERTER
IC34 IC48 = 74xx-us:74*02: Quad 2-input NOR gate
IC41 IC44 IC46 = 45xx:4503: Tri-state hex BUFFER, 74C367, 80C97
IC42 IC59 = 74xx-us:74*74: Dual D type positive edge triggered FLIP FLOP, preset and clear
IC47 = micro-intel:8749: MICROCOMPUTER/PERIPHERAL DEVICE; OC_FARNELL: unknown; OC_NEWARK: unknown
IC49 = 74xx-us:74*139: Dual 2-line to 4-line DECODER/DEMULTIPLEXER
IC53 = 74xx-us:74*153: Dual 4-line to 1-line data SELECTOR/MULTIPLEXER
IC54 IC55 = interface:14*89: Quad line receivers BUFFER,
IC57 IC58 = interface:14*88: Quad 2-input NAND gate
JP1 = pinhead:PINHD-1X100: PIN HEADER 100 pol. Grid 2.54mm
L1 = inductors:MCC10: INDUCTOR
LED2 = led:LED: LED OSRAM: - CHIPLED LG R971, LG N971, LY N971, LG Q971, LY Q971, LO R971, LY R971 LH N974, LH R974 LS Q976, LO Q976, LY Q976 LO Q996 - Hyper CHIPLED LW Q18S LB Q993, LB Q99A, LB R99A - SideLED LS A670, LO A670, LY A670, LG A670, LP A670 LB A673, LV A673, LT A673, LW A673 LH A674 LY A675 LS A676, LA A676, LO A676, LY A676, LW A676 LS A679, LY A679, LG A679 - Hyper Micro SIDELED® LS Y876, LA Y876, LO Y876, LY Y876 LT Y87S - SmartLED LW L88C, LW L88S LB L89C, LB L89S, LG L890 LS L89K, LO L89K, LY L89K LS L896, LA L896, LO L896, LY L896 - TOPLED LS T670, LO T670, LY T670, LG T670, LP T670 LSG T670, LSP T670, LSY T670, LOP T670, LYG T670 LG T671, LOG T671, LSG T671 LB T673, LV T673, LT T673, LW T673 LH T674 LS T676, LA T676, LO T676, LY T676, LB T676, LH T676, LSB T676, LW T676 LB T67C, LV T67C, LT T67C, LS T67K, LO T67K, LY T67K, LW E67C LS E67B, LA E67B, LO E67B, LY E67B, LB E67C, LV E67C, LT E67C LW T67C LS T679, LY T679, LG T679 LS T770, LO T770, LY T770, LG T770, LP T770 LB T773, LV T773, LT T773, LW T773 LH T774 LS E675, LA E675, LY E675, LS T675 LS T776, LA T776, LO T776, LY T776, LB T776 LHGB T686 LT T68C, LB T68C - Hyper Mini TOPLED® LB M676 - Mini TOPLED Santana® LG M470 LS M47K, LO M47K, LY M47K Source: http://www.osram.convergy.de LUXEON: - LUMILED® LXK2-PW12-R00, LXK2-PW12-S00, LXK2-PW14-U00, LXK2-PW14-V00 LXK2-PM12-R00, LXK2-PM12-S00, LXK2-PM14-U00 LXK2-PE12-Q00, LXK2-PE12-R00, LXK2-PE12-S00, LXK2-PE14-T00, LXK2-PE14-U00 LXK2-PB12-K00, LXK2-PB12-L00, LXK2-PB12-M00, LXK2-PB14-N00, LXK2-PB14-P00, LXK2-PB14-Q00 LXK2-PR12-L00, LXK2-PR12-M00, LXK2-PR14-Q00, LXK2-PR14-R00 LXK2-PD12-Q00, LXK2-PD12-R00, LXK2-PD12-S00 LXK2-PH12-R00, LXK2-PH12-S00 LXK2-PL12-P00, LXK2-PL12-Q00, LXK2-PL12-R00 Source: www.luxeon.com KINGBRIGHT: KA-3528ASYC Source: www.kingbright.com
R11-R20 = resistor:R-US_: RESISTOR, American symbol
RN1 RN4 RN5 = resistor-sil:G09R: SIL RESISTOR; OC_FARNELL: unknown; OC_NEWARK: unknown
SV2 = con-lstb:MA03-1: PIN HEADER; OC_FARNELL: unknown; OC_NEWARK: unknown
U2 = micro-harris:HD6402: MICROCONTROLLER/MEMORY DEVICE; OC_FARNELL: unknown; OC_NEWARK: unknown